# Altium schematic sheet Sheet1.SCHDOC
size 840 x 594 mm; SheetNumber: 1; SheetTotal: 1; DocumentName: Sheet1.SCHDOC
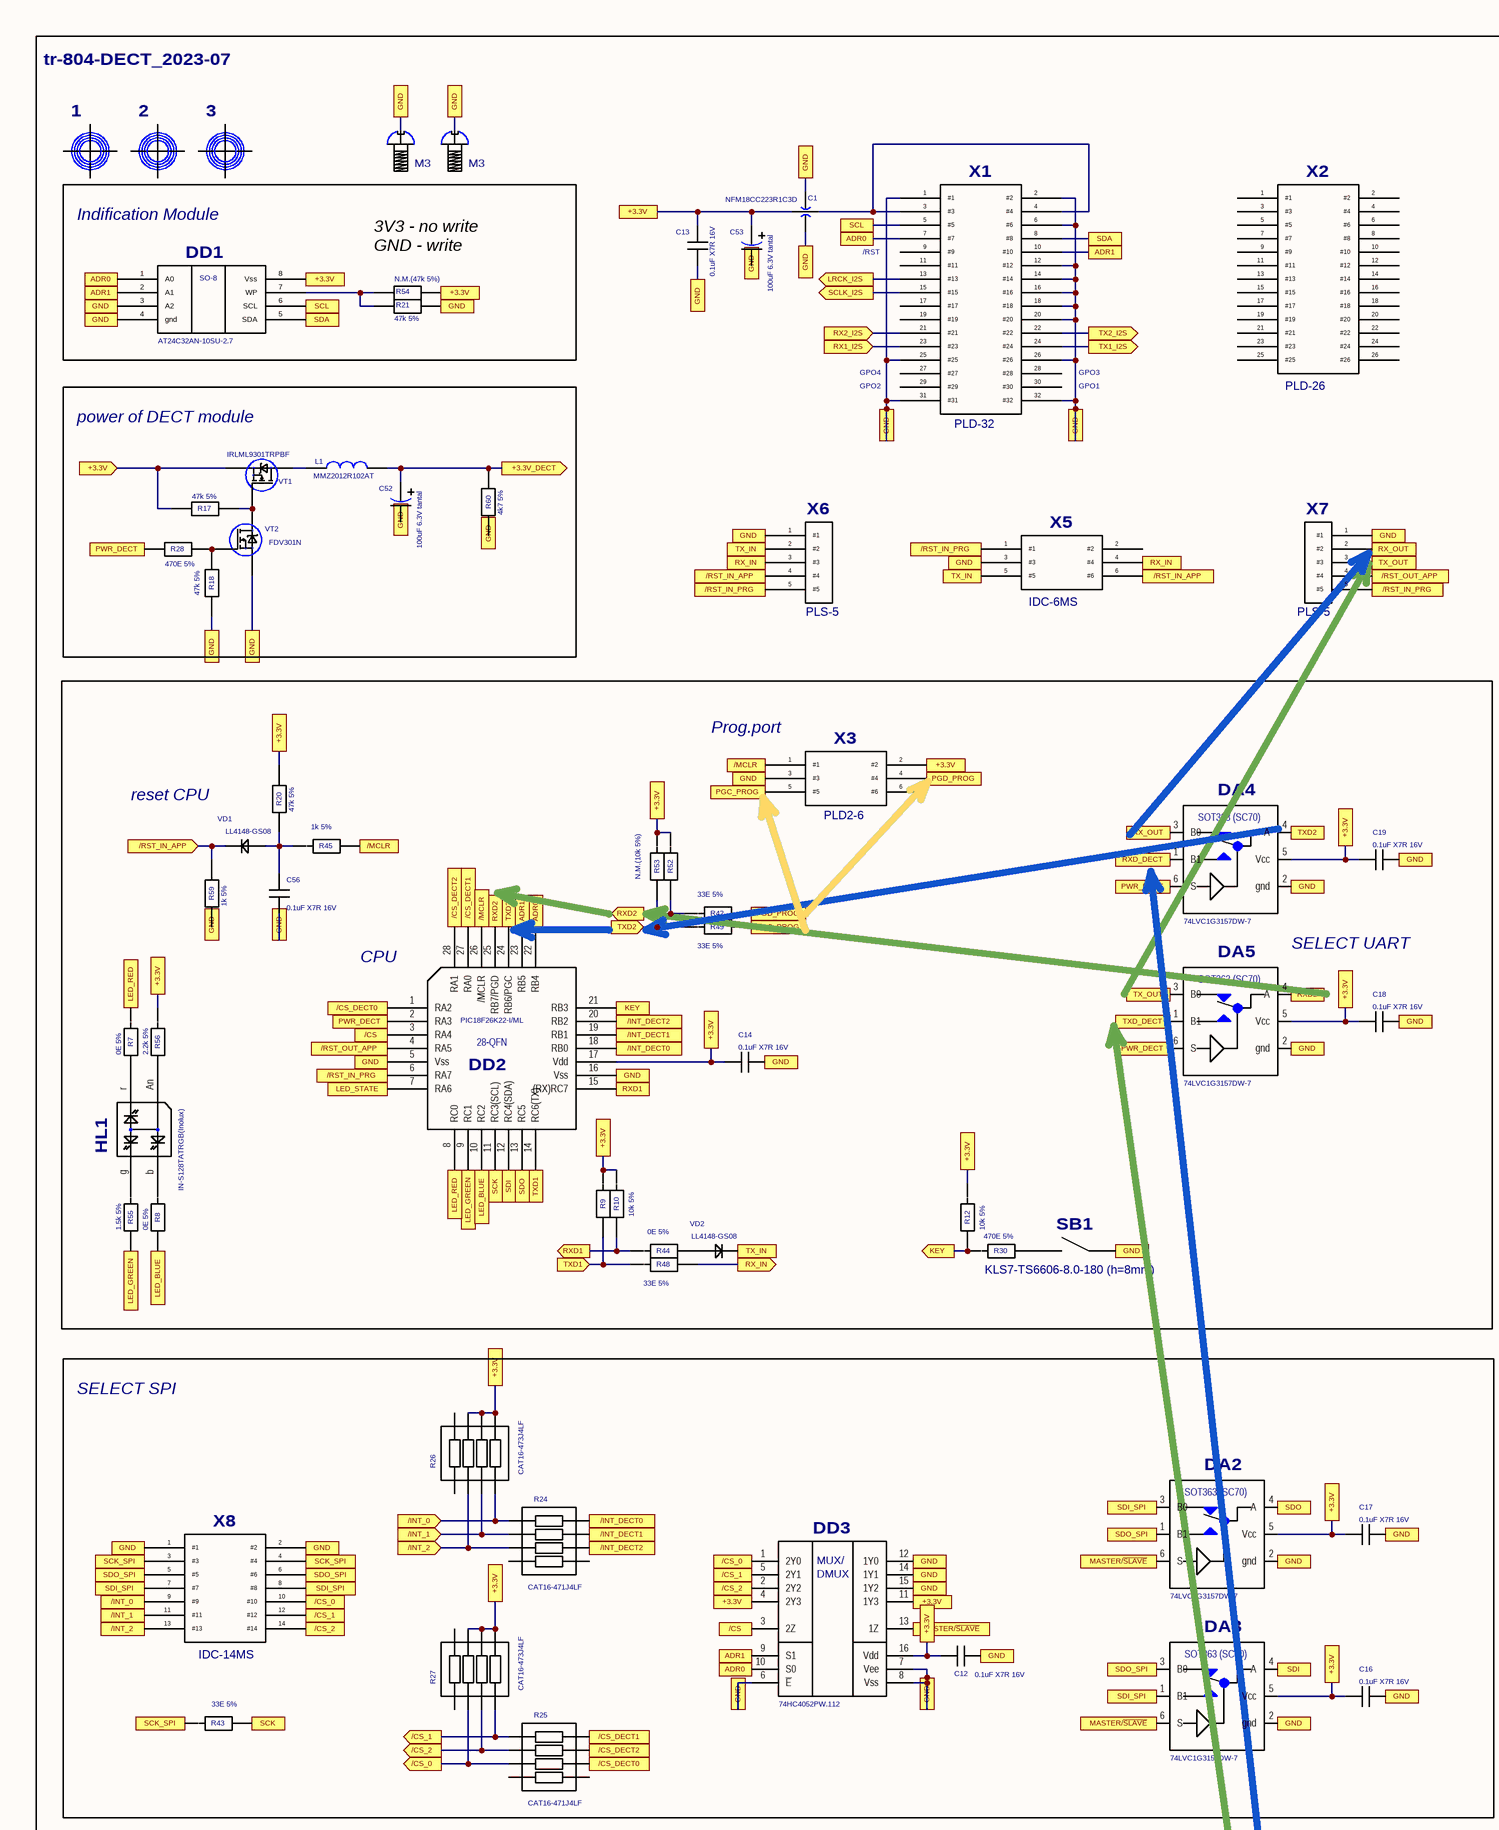
[diagram p0: Sheet1.SCHDOC, top left]
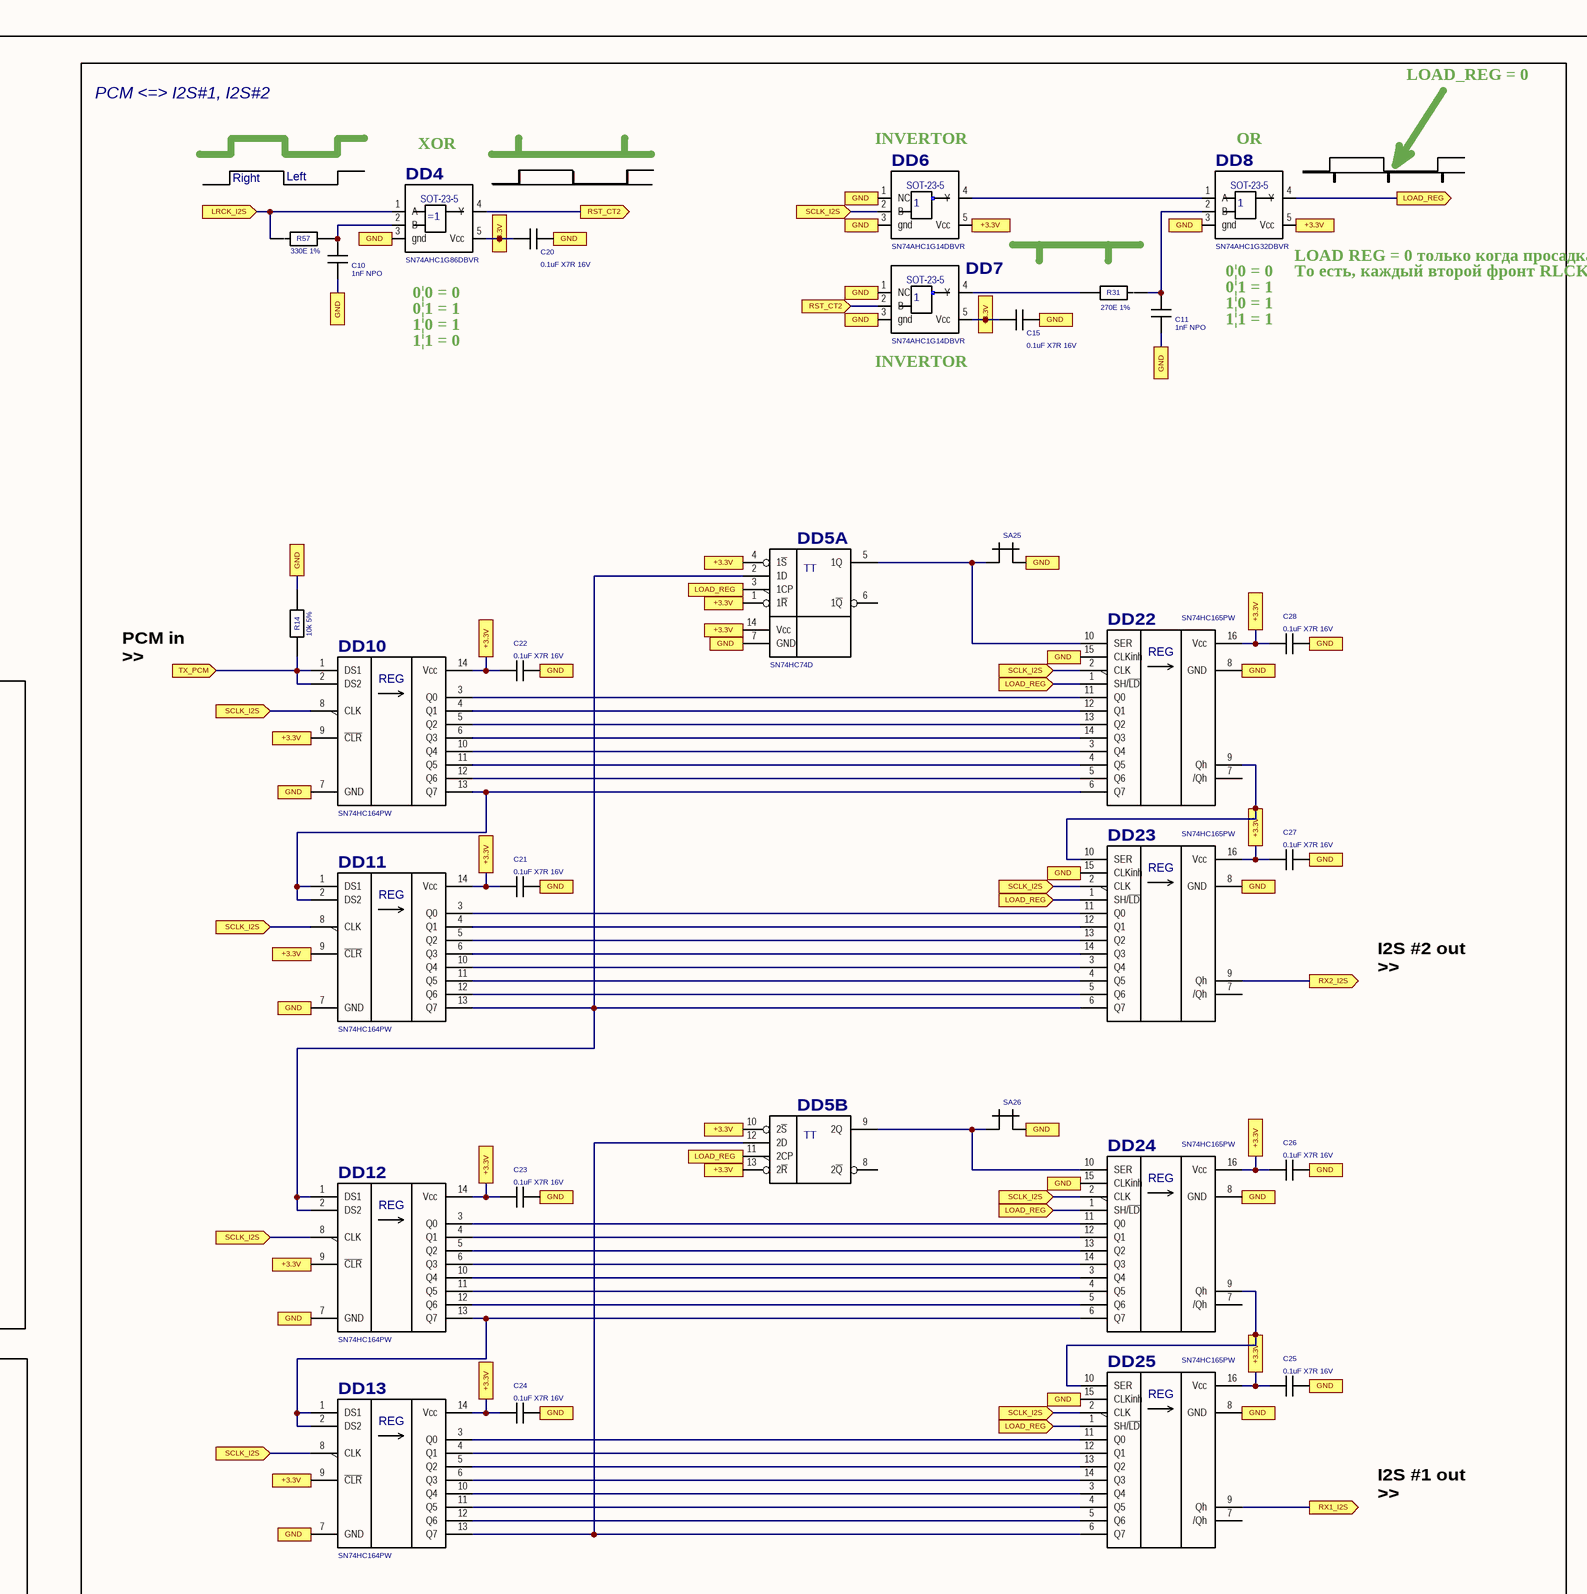
[diagram p1: Sheet1.SCHDOC, top middle]
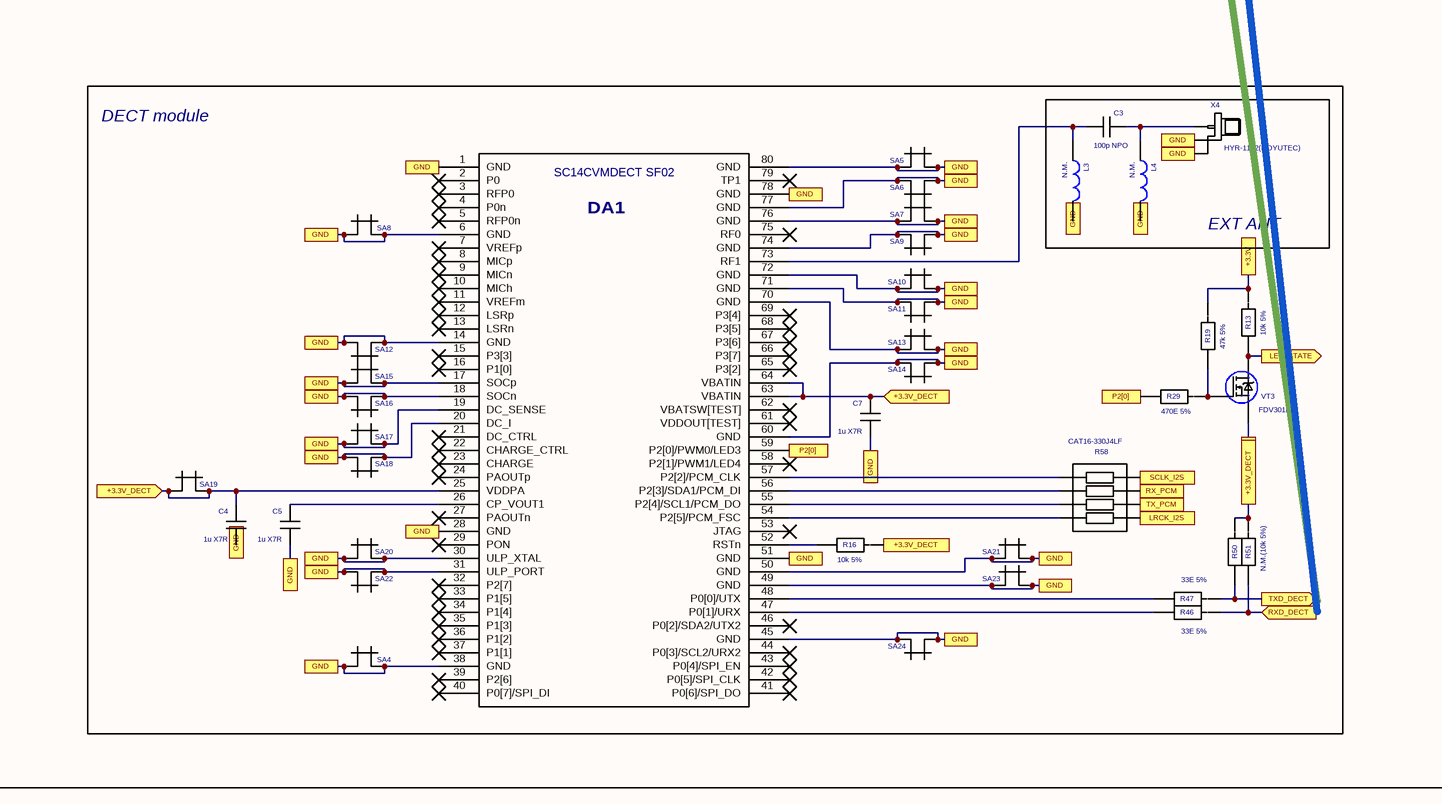
[diagram p2: Sheet1.SCHDOC, bottom left]
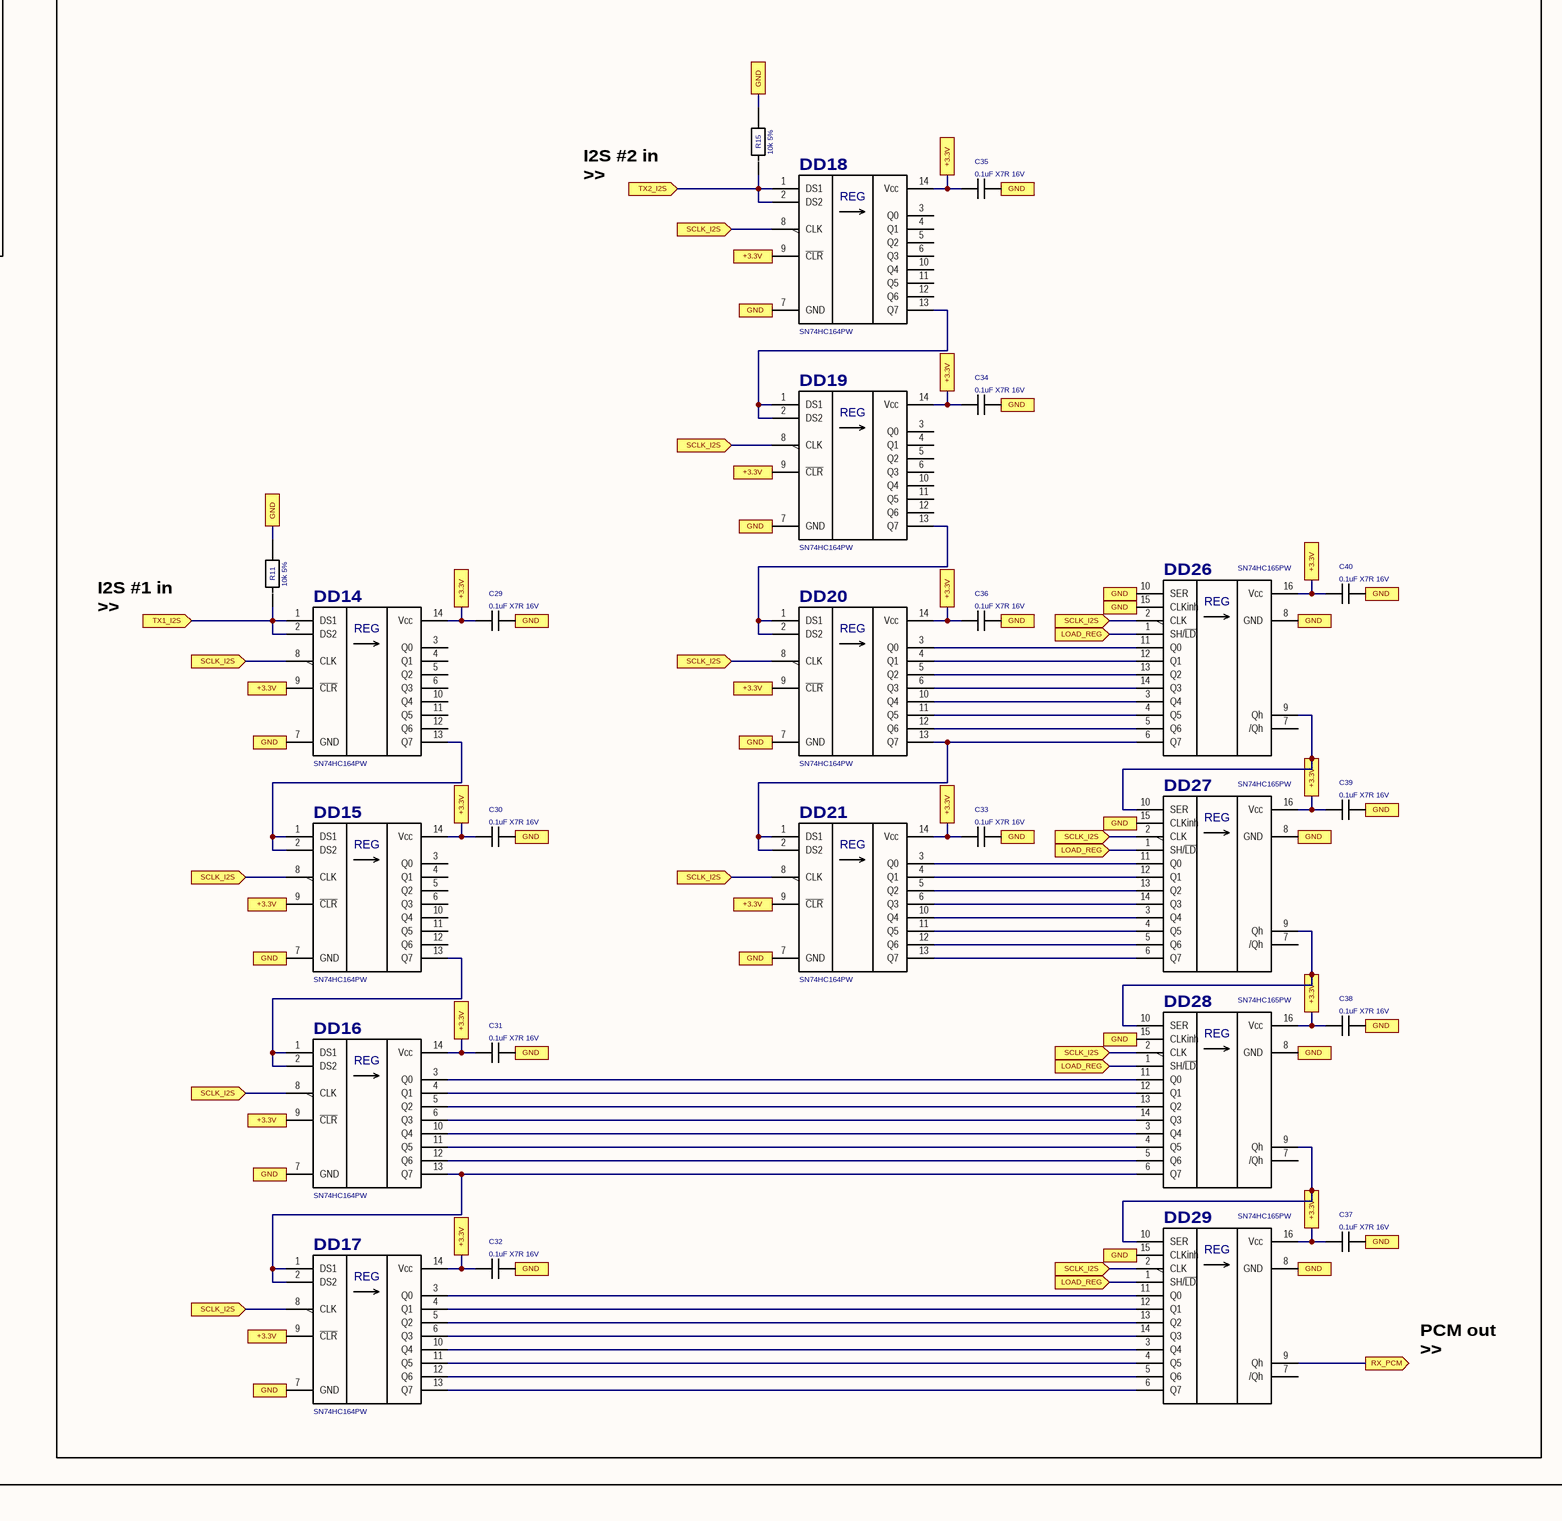
[diagram p3: Sheet1.SCHDOC, bottom middle]

## Parts
1  REPER_20-10  [REP_1]  (value not drawn)
2  REPER_20-10  [REP_1]  (value not drawn)
3  REPER_20-10  [REP_1]  (value not drawn)
C1  value NFM18CC223R1C3D  [0603_MURATA_NFM18PC]  (hidden comment: 0603_MURATA_NFM18PC)
C3  value 100p NPO  [0402]  (hidden comment: 0402_C)
C4  value 1u X7R  [0603]  (hidden comment: 0603_C)
C5  value 1u X7R  [0603]  (hidden comment: 0603_C)
C7  value 1u X7R  [0603]  (hidden comment: 0603_C)
C10  value 1nF NPO  [0603]  (hidden comment: 0603_C)
C11  value 1nF NPO  [0603]  (hidden comment: 0603_C)
C12  value 0.1uF X7R 16V  [0603]  (hidden comment: 0603_C)
C13  value 0.1uF X7R 16V  [0603]  (hidden comment: 0603_C)
C14  value 0.1uF X7R 16V  [0603]  (hidden comment: 0603_C)
C15  value 0.1uF X7R 16V  [0603]  (hidden comment: 0603_C)
C16  value 0.1uF X7R 16V  [0603]  (hidden comment: 0603_C)
C17  value 0.1uF X7R 16V  [0603]  (hidden comment: 0603_C)
C18  value 0.1uF X7R 16V  [0603]  (hidden comment: 0603_C)
C19  value 0.1uF X7R 16V  [0603]  (hidden comment: 0603_C)
C20  value 0.1uF X7R 16V  [0603]  (hidden comment: 0603_C)
C21  value 0.1uF X7R 16V  [0603]  (hidden comment: 0603_C)
C22  value 0.1uF X7R 16V  [0603]  (hidden comment: 0603_C)
C23  value 0.1uF X7R 16V  [0603]  (hidden comment: 0603_C)
C24  value 0.1uF X7R 16V  [0603]  (hidden comment: 0603_C)
C25  value 0.1uF X7R 16V  [0603]  (hidden comment: 0603_C)
C26  value 0.1uF X7R 16V  [0603]  (hidden comment: 0603_C)
C27  value 0.1uF X7R 16V  [0603]  (hidden comment: 0603_C)
C28  value 0.1uF X7R 16V  [0603]  (hidden comment: 0603_C)
C29  value 0.1uF X7R 16V  [0603]  (hidden comment: 0603_C)
C30  value 0.1uF X7R 16V  [0603]  (hidden comment: 0603_C)
C31  value 0.1uF X7R 16V  [0603]  (hidden comment: 0603_C)
C32  value 0.1uF X7R 16V  [0603]  (hidden comment: 0603_C)
C33  value 0.1uF X7R 16V  [0603]  (hidden comment: 0603_C)
C34  value 0.1uF X7R 16V  [0603]  (hidden comment: 0603_C)
C35  value 0.1uF X7R 16V  [0603]  (hidden comment: 0603_C)
C36  value 0.1uF X7R 16V  [0603]  (hidden comment: 0603_C)
C37  value 0.1uF X7R 16V  [0603]  (hidden comment: 0603_C)
C38  value 0.1uF X7R 16V  [0603]  (hidden comment: 0603_C)
C39  value 0.1uF X7R 16V  [0603]  (hidden comment: 0603_C)
C40  value 0.1uF X7R 16V  [0603]  (hidden comment: 0603_C)
C52  value 100uF 6.3V tantal  [CASE_B]  (hidden comment: CASEB_C+)
C53  value 100uF 6.3V tantal  [CASE_B]  (hidden comment: CASEB_C+)
C56  value 0.1uF X7R 16V  [0603]  (hidden comment: 0603_C)
DA1  value SC14CVMDECT SF02  [SC14CVMDECT(DECT)]  (hidden comment: DECT_SC14CVMDECT)
DA2  value 74LVC1G3157DW-7  [SC70-6]  (hidden comment: DA_SN74LVC(SWITCH-SOT363))
DA3  value 74LVC1G3157DW-7  [SC70-6]  (hidden comment: DA_SN74LVC(SWITCH-SOT363))
DA4  value 74LVC1G3157DW-7  [SC70-6]  (hidden comment: DA_SN74LVC(SWITCH-SOT363))
DA5  value 74LVC1G3157DW-7  [SC70-6]  (hidden comment: DA_SN74LVC(SWITCH-SOT363))
DD1  value AT24C32AN-10SU-2.7  [SO-8-1.27_PANTES]  (hidden comment: DD_AT24CXXX)
DD2  value PIC18F26K22-I/ML  [QFN-28(6X6)]  (hidden comment: DD_PIC18F2XK22(QFN))
DD3  value 74HC4052PW.112  [TSSOP-16-0.65_PANTES]  (hidden comment: DD_74HC4052PW)
DD4  value SN74AHC1G86DBVR  [SOT-25]  (hidden comment: DD_SN74AHC1G86DBVR(2XOR))
DD5  value SN74HC74D  [SO-14-1.27]  (hidden comment: DD_SN74HC74D)  (parts A,B of 2)
DD6  value SN74AHC1G14DBVR  [SOT-25]  (hidden comment: DD_SN74AHC1G14DBVR(NOT))
DD7  value SN74AHC1G14DBVR  [SOT-25]  (hidden comment: DD_SN74AHC1G14DBVR(NOT))
DD8  value SN74AHC1G32DBVR  [SOT-25]  (hidden comment: DD_SN74AHC1G32DBVR(2OR))
DD10  value SN74HC164PW  [TSSOP-14-0.65_PANTES]  (hidden comment: DD_SN74HC164PW)
DD11  value SN74HC164PW  [TSSOP-14-0.65_PANTES]  (hidden comment: DD_SN74HC164PW)
DD12  value SN74HC164PW  [TSSOP-14-0.65_PANTES]  (hidden comment: DD_SN74HC164PW)
DD13  value SN74HC164PW  [TSSOP-14-0.65_PANTES]  (hidden comment: DD_SN74HC164PW)
DD14  value SN74HC164PW  [TSSOP-14-0.65_PANTES]  (hidden comment: DD_SN74HC164PW)
DD15  value SN74HC164PW  [TSSOP-14-0.65_PANTES]  (hidden comment: DD_SN74HC164PW)
DD16  value SN74HC164PW  [TSSOP-14-0.65_PANTES]  (hidden comment: DD_SN74HC164PW)
DD17  value SN74HC164PW  [TSSOP-14-0.65_PANTES]  (hidden comment: DD_SN74HC164PW)
DD18  value SN74HC164PW  [TSSOP-14-0.65_PANTES]  (hidden comment: DD_SN74HC164PW)
DD19  value SN74HC164PW  [TSSOP-14-0.65_PANTES]  (hidden comment: DD_SN74HC164PW)
DD20  value SN74HC164PW  [TSSOP-14-0.65_PANTES]  (hidden comment: DD_SN74HC164PW)
DD21  value SN74HC164PW  [TSSOP-14-0.65_PANTES]  (hidden comment: DD_SN74HC164PW)
DD22  value SN74HC165PW  [TSSOP-16-0.65_PANTES]  (hidden comment: DD_SN74HC165PW)
DD23  value SN74HC165PW  [TSSOP-16-0.65_PANTES]  (hidden comment: DD_SN74HC165PW)
DD24  value SN74HC165PW  [TSSOP-16-0.65_PANTES]  (hidden comment: DD_SN74HC165PW)
DD25  value SN74HC165PW  [TSSOP-16-0.65_PANTES]  (hidden comment: DD_SN74HC165PW)
DD26  value SN74HC165PW  [TSSOP-16-0.65_PANTES]  (hidden comment: DD_SN74HC165PW)
DD27  value SN74HC165PW  [TSSOP-16-0.65_PANTES]  (hidden comment: DD_SN74HC165PW)
DD28  value SN74HC165PW  [TSSOP-16-0.65_PANTES]  (hidden comment: DD_SN74HC165PW)
DD29  value SN74HC165PW  [TSSOP-16-0.65_PANTES]  (hidden comment: DD_SN74HC165PW)
HL1  value IN-S128TATRGB(Inolux)  [1210LED_LPE1-5-19]  (hidden comment: LED_1210(LPE1-5-19))
L1  value MMZ2012R102AT  [0805]  (hidden comment: 0805_L)
L3  value N.M.  [0402]  (hidden comment: 0402_L)
L4  value N.M.  [0402]  (hidden comment: 0402_L)
M1  value M3  [M32]  (hidden comment: BOLT)
M2  value M3  [M32]  (hidden comment: BOLT)
R7  value 0E 5%  [0805]  (hidden comment: 0805_R)
R8  value 0E 5%  [0805]  (hidden comment: 0805_R)
R9  0603_R  [0603]  (value not drawn)
R10  value 10k 5%  [0603]  (hidden comment: 0603_R)
R11  value 10k 5%  [0603]  (hidden comment: 0603_R)
R12  value 10k 5%  [0603]  (hidden comment: 0603_R)
R13  value 10k 5%  [0603]  (hidden comment: 0603_R)
R14  value 10k 5%  [0603]  (hidden comment: 0603_R)
R15  value 10k 5%  [0603]  (hidden comment: 0603_R)
R16  value 10k 5%  [0603]  (hidden comment: 0603_R)
R17  value 47k 5%  [0603]  (hidden comment: 0603_R)
R18  value 47k 5%  [0603]  (hidden comment: 0603_R)
R19  value 47k 5%  [0603]  (hidden comment: 0603_R)
R20  value 47k 5%  [0603]  (hidden comment: 0603_R)
R21  value 47k 5%  [0603]  (hidden comment: 0603_R)
R24  value CAT16-471J4LF  [CAY16-J4]  (hidden comment: 0603_R_CAY16-J)
R25  value CAT16-471J4LF  [CAY16-J4]  (hidden comment: 0603_R_CAY16-J)
R26  value CAT16-473J4LF  [CAY16-J4]  (hidden comment: 0603_R_CAY16-J)
R27  value CAT16-473J4LF  [CAY16-J4]  (hidden comment: 0603_R_CAY16-J)
R28  value 470E 5%  [0603]  (hidden comment: 0603_R)
R29  value 470E 5%  [0603]  (hidden comment: 0603_R)
R30  value 470E 5%  [0603]  (hidden comment: 0603_R)
R31  value 270E 1%  [0603]  (hidden comment: 0603_R)
R42  value 33E 5%  [0603]  (hidden comment: 0603_R)
R43  value 33E 5%  [0603]  (hidden comment: 0603_R)
R44  value 0E 5%  [0603]  (hidden comment: 0603_R)
R45  value 1k 5%  [0603]  (hidden comment: 0603_R)
R46  value 33E 5%  [0603]  (hidden comment: 0603_R)
R47  value 33E 5%  [0603]  (hidden comment: 0603_R)
R48  value 33E 5%  [0603]  (hidden comment: 0603_R)
R49  value 33E 5%  [0603]  (hidden comment: 0603_R)
R50  0603_R  [0603]  (value not drawn)
R51  value N.M.(10k 5%)  [0603]  (hidden comment: 0603_R)
R52  value N.M.(10k 5%)  [0603]  (hidden comment: 0603_R)
R53  0603_R  [0603]  (value not drawn)
R54  value N.M.(47k 5%)  [0603]  (hidden comment: 0603_R)
R55  value 1.5k 5%  [0805]  (hidden comment: 0805_R)
R56  value 2.2k 5%  [0805]  (hidden comment: 0805_R)
R57  value 330E 1%  [0603]  (hidden comment: 0603_R)
R58  value CAT16-330J4LF  [CAY16-J4]  (hidden comment: 0603_R_CAY16-J)
R59  value 1k 5%  [0603]  (hidden comment: 0603_R)
R60  value 4k7 5%  [0603]  (hidden comment: 0603_R)
SA4  JUMPER_0603  [JUMPER_0603]  (value not drawn)
SA5  JUMPER_0603  [JUMPER_0603]  (value not drawn)
SA6  JUMPER_0603  [JUMPER_0603]  (value not drawn)
SA7  JUMPER_0603  [JUMPER_0603]  (value not drawn)
SA8  JUMPER_0603  [JUMPER_0603]  (value not drawn)
SA9  JUMPER_0603  [JUMPER_0603]  (value not drawn)
SA10  JUMPER_0603  [JUMPER_0603]  (value not drawn)
SA11  JUMPER_0603  [JUMPER_0603]  (value not drawn)
SA12  JUMPER_0603  [JUMPER_0603]  (value not drawn)
SA13  JUMPER_0603  [JUMPER_0603]  (value not drawn)
SA14  JUMPER_0603  [JUMPER_0603]  (value not drawn)
SA15  JUMPER_0603  [JUMPER_0603]  (value not drawn)
SA16  JUMPER_0603  [JUMPER_0603]  (value not drawn)
SA17  JUMPER_0603  [JUMPER_0603]  (value not drawn)
SA18  JUMPER_0603  [JUMPER_0603]  (value not drawn)
SA19  JUMPER_0603  [JUMPER_0603]  (value not drawn)
SA20  JUMPER_0603  [JUMPER_0603]  (value not drawn)
SA21  JUMPER_0603  [JUMPER_0603]  (value not drawn)
SA22  JUMPER_0603  [JUMPER_0603]  (value not drawn)
SA23  JUMPER_0603  [JUMPER_0603]  (value not drawn)
SA24  JUMPER_0603  [JUMPER_0603]  (value not drawn)
SA25  JUMPER_0603  [JUMPER_0603]  (value not drawn)
SA26  JUMPER_0603  [JUMPER_0603]  (value not drawn)
SB1  value KLS7-TS6606-8.0-180 (h=8mm)  [BUTTON_TC-0206]  (hidden comment: BUT_TC-0206)
VD1  value LL4148-GS08  [SOD80C]  (hidden comment: DIOD_SOD80C)
VD2  value LL4148-GS08  [SOD80C]  (hidden comment: DIOD_SOD80C)
VT1  value IRLML9301TRPBF  [SOT-23]  (hidden comment: VT_FDN338P)
VT2  value FDV301N  [SOT-23]  (hidden comment: VT_FDV301N)
VT3  value FDV301N  [SOT-23]  (hidden comment: VT_FDV301N)
X1  value PLD-32  [PBD-32]  (hidden comment: X_PBD-32)
X2  value PLD-26  [PBD-26]  (hidden comment: X_PBD-26)
X3  value PLD2-6  [PBD2-6]  (hidden comment: X_PBD2-6)
X4  value HYR-1142(HOYUTEC)  [SMA_HYR-1142]  (hidden comment: X_SMA_HYR-1142)
X5  value IDC-6MS  [IDC-6]  (hidden comment: X_IDC-6)
X6  value PLS-5  [PLS-5]  (hidden comment: X_PLS-5)
X7  value PLS-5  [PLS-5]  (hidden comment: X_PLS-5)
X8  value IDC-14MS  [IDC-14]  (hidden comment: X_IDC-14)

## Blocks framed on the sheet
Indification Module: DD1 R21 R54
power of DECT module: C52 L1 R17 R18 R28 R60 VT1 VT2
SELECT SPI: C12 C16 C17 DA2 DA3 DD3 R24-R27 R43 X8
DECT module: C4 C5 C7 DA1 R13 R16 R19 R29 R46 R47 R50 R51 R58 SA4-SA24 VT3
EXT ANT: C3 L3 L4 X4

## Ports
+3.3V, +3.3V (in), +3.3V_DECT, +3.3V_DECT (in), +3.3V_DECT (out), /CS (in), /CS (out), /CS_0, /CS_0 (in), /CS_0 (out), /CS_1, /CS_1 (in), /CS_1 (out), /CS_2, /CS_2 (in), /CS_2 (out), /CS_DECT0 (in), /CS_DECT0 (out), /CS_DECT1 (in), /CS_DECT1 (out), /CS_DECT2 (in), /CS_DECT2 (out), /INT_0, /INT_0 (in), /INT_1, /INT_1 (in), /INT_2, /INT_2 (in), /INT_DECT0 (in), /INT_DECT0 (out), /INT_DECT1 (in), /INT_DECT1 (out), /INT_DECT2 (in), /INT_DECT2 (out), /MCLR, /MCLR (in), /MCLR (out), /RST_IN_APP, /RST_IN_APP (in), /RST_IN_PRG, /RST_IN_PRG (in), /RST_OUT_APP, /RST_OUT_APP (out), ADR0, ADR0 (in), ADR1, ADR1 (in), GND, KEY (in), KEY (out), LED_BLUE, LED_BLUE (out), LED_GREEN, LED_GREEN (out), LED_RED, LED_RED (out), LED_STATE (in), LED_STATE (out), LOAD_REG (in), LOAD_REG (out), LRCK_I2S (in), LRCK_I2S (out), MASTER/~{SLAVE} (in), MASTER/~{SLAVE} (out), P2[0] (in), P2[0] (out), PGC_PROG, PGD_PROG, PWR_DECT (in), PWR_DECT (out), RST_CT2 (in), RST_CT2 (out), RX1_I2S (in), RX1_I2S (out), RX2_I2S (in), RX2_I2S (out), RX_IN, RX_IN (out), RX_OUT, RX_OUT (out), RX_PCM (in), RX_PCM (out), RXD1 (in), RXD1 (out), RXD2 (in), RXD2 (out), RXD_DECT (in), RXD_DECT (out), SCK, SCK_SPI, SCL, SCLK_I2S (in), SCLK_I2S (out), SDA, SDI (in), SDI (out), SDI_SPI, SDI_SPI (in), SDI_SPI (out), SDO (in), SDO (out), SDO_SPI, SDO_SPI (in), SDO_SPI (out), TX1_I2S (in), TX1_I2S (out), TX2_I2S (in), TX2_I2S (out), TX_IN, TX_IN (in), TX_OUT, TX_OUT (in), TX_PCM (in), TX_PCM (out), TXD1 (in), TXD1 (out), TXD2 (in), TXD2 (out), TXD_DECT (in), TXD_DECT (out)

## Nets
+3.3V: C1.3 C12.1 C13.1 C14.1 C15.1 C16.1 C17.1 C18.1 C19.1 C20.1 C21.1 C22.1 C23.1 C24.1 C25.1 C26.1 C27.1 C28.1 C29.1 C30.1 C31.1 C32.1 C33.1 C34.1 C35.1 C36.1 C37.1 C38.1 C39.1 C40.1 C53.1 DA2.5(Vcc) DA3.5(Vcc) DA4.5(Vcc) DA5.5(Vcc) DD1.8(Vss) DD2.17(Vdd) DD3.4(2Y3) DD3.11(1Y3) DD3.16(Vdd) DD4.5(Vcc) DD5.1(1~{R}) DD5.4(1~{S}) DD5.10(2~{S}) DD5.13(2~{R}) DD5.14(Vcc) DD6.5(Vcc) DD7.5(Vcc) DD8.5(Vcc) DD10.9(~{CLR}) DD10.14(Vcc) DD11.9(~{CLR}) DD11.14(Vcc) DD12.9(~{CLR}) DD12.14(Vcc) DD13.9(~{CLR}) DD13.14(Vcc) DD14.9(~{CLR}) DD14.14(Vcc) DD15.9(~{CLR}) DD15.14(Vcc) DD16.9(~{CLR}) DD16.14(Vcc) DD17.9(~{CLR}) DD17.14(Vcc) DD18.9(~{CLR}) DD18.14(Vcc) DD19.9(~{CLR}) DD19.14(Vcc) DD20.9(~{CLR}) DD20.14(Vcc) DD21.9(~{CLR}) DD21.14(Vcc) DD22.9(Qh) DD22.16(Vcc) DD23.10(SER) DD23.16(Vcc) DD24.9(Qh) DD24.16(Vcc) DD25.10(SER) DD25.16(Vcc) DD26.9(Qh) DD26.16(Vcc) DD27.9(Qh) DD27.10(SER) DD27.16(Vcc) DD28.9(Qh) DD28.10(SER) DD28.16(Vcc) DD29.10(SER) DD29.16(Vcc) R9.2 R10.2 R12.2 R13.2 R17.1 R19.2 R20.1 R26.4 R26.6 R26.8 R27.4 R27.6 R27.8 R52.2 R53.2 R54.2 R56.2 VT1.3(S) X3.2(#2) ; port +3.3V
+3.3V_DECT: C4.1 C7.1 C52.1 DA1.25(VDDPA) DA1.63(VBATIN) DA1.64(VBATIN) L1.2 R16.2 R50.2 R51.2 R60.1 SA19.1(#1) SA19.2(#2) ; port +3.3V_DECT
/CS: DD2.3(RA4) DD3.3(2Z) ; port /CS
/CS_0: DD3.1(2Y0) R25.5 R27.3 X8.10(#10) ; port /CS_0
/CS_1: DD3.5(2Y1) R25.1 R27.7 X8.12(#12) ; port /CS_1
/CS_2: DD3.2(2Y2) R25.3 R27.5 X8.14(#14) ; port /CS_2
/CS_DECT0: DD2.1(RA2) R25.6 ; port /CS_DECT0
/CS_DECT1: DD2.27(RA0) R25.2 ; port /CS_DECT1
/CS_DECT2: DD2.28(RA1) R25.4 ; port /CS_DECT2
/INT_0: R24.1 R26.7 X8.9(#9) ; port /INT_0
/INT_1: R24.3 R26.5 X8.11(#11) ; port /INT_1
/INT_2: R24.5 R26.3 X8.13(#13) ; port /INT_2
/INT_DECT0: DD2.18(RB0) R24.2 ; port /INT_DECT0
/INT_DECT1: DD2.19(RB1) R24.4 ; port /INT_DECT1
/INT_DECT2: DD2.20(RB2) R24.6 ; port /INT_DECT2
/MCLR: DD2.26(/MCLR) R45.1 X3.1(#1) ; port /MCLR
/RST_IN_APP: R59.1 VD1.K X5.6(#6) X6.4(#4) ; port /RST_IN_APP
/RST_IN_PRG: DD2.6(RA7) X5.1(#1) X6.5(#5) X7.5(#5) ; port /RST_IN_PRG
/RST_OUT_APP: DD2.4(RA5) X7.4(#4) ; port /RST_OUT_APP
ADR0: DD1.1(A0) DD2.22(RB4) DD3.10(S0) X1.7(#7) ; port ADR0
ADR1: DD1.2(A1) DD2.23(RB5) DD3.9(S1) X1.10(#10) ; port ADR1
GND: C1.2 C1.4 C4.2 C5.2 C7.2 C10.2 C11.2 C12.2 C13.2 C14.2 C15.2 C16.2 C17.2 C18.2 C19.2 C20.2 C21.2 C22.2 C23.2 C24.2 C25.2 C26.2 C27.2 C28.2 C29.2 C30.2 C31.2 C32.2 C33.2 C34.2 C35.2 C36.2 C37.2 C38.2 C39.2 C40.2 C52.2 C53.2 C56.2 DA1.1(GND) DA1.6(GND) DA1.14(GND) DA1.17(SOCp) DA1.18(SOCn) DA1.19(DC_SENSE) DA1.20(DC_I) DA1.28(GND) DA1.30(ULP_XTAL) DA1.31(ULP_PORT) DA1.38(GND) DA1.45(GND) DA1.49(GND) DA1.50(GND) DA1.51(GND) DA1.60(GND) DA1.70(GND) DA1.71(GND) DA1.72(GND) DA1.74(GND) DA1.76(GND) DA1.77(GND) DA1.78(GND) DA1.80(GND) DA2.2(gnd) DA3.2(gnd) DA4.2(gnd) DA5.2(gnd) DD1.3(A2) DD1.4(gnd) DD2.5(Vss) DD2.16(Vss) DD3.6(~{E}) DD3.7(Vee) DD3.8(Vss) DD3.12(1Y0) DD3.14(1Y1) DD3.15(1Y2) DD4.3(gnd) DD5.7(GND) DD6.1(NC) DD6.3(gnd) DD7.1(NC) DD7.3(gnd) DD8.3(gnd) DD10.7(GND) DD11.7(GND) DD12.7(GND) DD13.7(GND) DD14.7(GND) DD15.7(GND) DD16.7(GND) DD17.7(GND) DD18.7(GND) DD19.7(GND) DD20.7(GND) DD21.7(GND) DD22.8(GND) DD22.15(CLKinh) DD23.8(GND) DD23.15(CLKinh) DD24.8(GND) DD24.15(CLKinh) DD25.8(GND) DD25.15(CLKinh) DD26.8(GND) DD26.10(SER) DD26.15(CLKinh) DD27.8(GND) DD27.15(CLKinh) DD28.8(GND) DD28.15(CLKinh) DD29.8(GND) DD29.15(CLKinh) L3.2 L4.2 M1.1 M2.1 R11.1 R14.1 R15.1 R18.2 R21.2 R59.2 R60.2 SA4.1(#1) SA4.2(#2) SA5.1(#1) SA5.2(#2) SA6.1(#1) SA6.2(#2) SA7.1(#1) SA7.2(#2) SA8.1(#1) SA8.2(#2) SA9.1(#1) SA9.2(#2) SA10.1(#1) SA10.2(#2) SA11.1(#1) SA11.2(#2) SA12.1(#1) SA12.2(#2) SA13.1(#1) SA13.2(#2) SA14.1(#1) SA14.2(#2) SA15.1(#1) SA15.2(#2) SA16.1(#1) SA16.2(#2) SA17.1(#1) SA17.2(#2) SA18.1(#1) SA18.2(#2) SA20.1(#1) SA20.2(#2) SA21.1(#1) SA21.2(#2) SA22.1(#1) SA22.2(#2) SA23.1(#1) SA23.2(#2) SA24.1(#1) SA24.2(#2) SA25.2(#2) SA26.2(#2) SB1.1 VT2.3(S) VT3.3(S) X1.1(#1) X1.2(#2) X1.6(#6) X1.12(#12) X1.14(#14) X1.16(#16) X1.18(#18) X1.20(#20) X1.25(#25) X1.26(#26) X1.31(#31) X1.32(#32) X3.3(#3) X4.2 X4.3 X5.3(#3) X6.1(#1) X7.1(#1) X8.1(#1) X8.2(#2) ; port GND
KEY: DD2.21(RB3) R12.1 R30.2 ; port KEY
LED_BLUE: DD2.10(RC2) R8.1 ; port LED_BLUE
LED_GREEN: DD2.9(RC1) R55.1 ; port LED_GREEN
LED_RED: DD2.8(RC0) R7.2 ; port LED_RED
LED_STATE: DD2.7(RA6) R13.1 VT3.2(D) ; port LED_STATE
LOAD_REG: DD5.3(1CP) DD5.11(2CP) DD8.4(Y) DD22.1(SH/~{LD}) DD23.1(SH/~{LD}) DD24.1(SH/~{LD}) DD25.1(SH/~{LD}) DD26.1(SH/~{LD}) DD27.1(SH/~{LD}) DD28.1(SH/~{LD}) DD29.1(SH/~{LD}) ; port LOAD_REG
LRCK_I2S: DD4.1(A) R57.2 R58.8 X1.13(#13) ; port LRCK_I2S
MASTER/~{SLAVE}: DA2.6(S) DA3.6(S) DD3.13(1Z) ; port MASTER/~{SLAVE}
P2[0]: DA1.59(P2[0]/PWM0/LED3) R29.1 ; port P2[0]
PGC_PROG: R49.1 X3.5(#5) ; port PGC_PROG
PGD_PROG: R42.1 X3.4(#4) ; port PGD_PROG
PWR_DECT: DA4.6(S) DA5.6(S) DD2.2(RA3) R28.1 ; port PWR_DECT
RST_CT2: DD4.4(Y) DD7.2(B) ; port RST_CT2
RX1_I2S: DD25.9(Qh) X1.23(#23) ; port RX1_I2S
RX2_I2S: DD23.9(Qh) X1.21(#21) ; port RX2_I2S
RX_IN: R48.1 X5.4(#4) X6.3(#3) ; port RX_IN
RX_OUT: DA4.3(B0) X7.2(#2) ; port RX_OUT
RX_PCM: DD29.9(Qh) R58.4 ; port RX_PCM
RXD1: DD2.15((RX)RC7) R10.1 R44.2 ; port RXD1
RXD2: DA5.4(A) DD2.25(RB7/PGD) R42.2 R52.1 ; port RXD2
RXD_DECT: DA4.1(B1) R46.2 R51.1 ; port RXD_DECT
SCK: DD2.11(RC3(SCL)) R43.1 ; port SCK
SCK_SPI: R43.2 X8.3(#3) X8.4(#4) ; port SCK_SPI
SCL: DD1.6(SCL) X1.5(#5) ; port SCL
SCLK_I2S: DD6.2(B) DD10.8(CLK) DD11.8(CLK) DD12.8(CLK) DD13.8(CLK) DD14.8(CLK) DD15.8(CLK) DD16.8(CLK) DD17.8(CLK) DD18.8(CLK) DD19.8(CLK) DD20.8(CLK) DD21.8(CLK) DD22.2(CLK) DD23.2(CLK) DD24.2(CLK) DD25.2(CLK) DD26.2(CLK) DD27.2(CLK) DD28.2(CLK) DD29.2(CLK) R58.2 X1.15(#15) ; port SCLK_I2S
SDA: DD1.5(SDA) X1.8(#8) ; port SDA
SDI: DA3.4(A) DD2.12(RC4(SDA)) ; port SDI
SDI_SPI: DA2.3(B0) DA3.1(B1) X8.7(#7) X8.8(#8) ; port SDI_SPI
SDO: DA2.4(A) DD2.13(RC5) ; port SDO
SDO_SPI: DA2.1(B1) DA3.3(B0) X8.5(#5) X8.6(#6) ; port SDO_SPI
TX1_I2S: DD14.1(DS1) DD14.2(DS2) R11.2 X1.24(#24) ; port TX1_I2S
TX2_I2S: DD18.1(DS1) DD18.2(DS2) R15.2 X1.22(#22) ; port TX2_I2S
TX_IN: VD2.K X5.5(#5) X6.2(#2) ; port TX_IN
TX_OUT: DA5.3(B0) X7.3(#3) ; port TX_OUT
TX_PCM: DD10.1(DS1) DD10.2(DS2) R14.2 R58.6 ; port TX_PCM
TXD1: DD2.14(RC6(TX)) R9.1 R48.2 ; port TXD1
TXD2: DA4.4(A) DD2.24(RB6/PGC) R49.2 R53.1 ; port TXD2
TXD_DECT: DA5.1(B1) R47.2 R50.1 ; port TXD_DECT
NetC1_1: C1.1 X1.3(#3) X1.4(#4)
NetC3_1: C3.1 DA1.73(RF1) L3.1
NetC3_2: C3.2 L4.1 X4.1
NetC5_1: C5.1 DA1.26(CP_VOUT1)
NetC10_1: C10.1 DD4.2(B) R57.1
NetC11_1: C11.1 DD8.2(B) R31.2
NetC56_1: C56.1 R20.2 R45.2 VD1.A
NetDA1_47: DA1.47(P0[1]/URX) R46.1
NetDA1_48: DA1.48(P0[0]/UTX) R47.1
NetDA1_52: DA1.52(RSTn) R16.1
NetDA1_54: DA1.54(P2[5]/PCM_FSC) R58.7
NetDA1_55: DA1.55(P2[4]/SCL1/PCM_DO) R58.5
NetDA1_56: DA1.56(P2[3]/SDA1/PCM_DI) R58.3
NetDA1_57: DA1.57(P2[2]/PCM_CLK) R58.1
NetDD1_7: DD1.7(WP) R21.1 R54.1
NetDD5_2: DD5.2(1D) DD11.13(Q7) DD12.1(DS1) DD12.2(DS2) DD23.6(Q7)
NetDD5_5: DD5.5(1Q) DD22.10(SER) SA25.1(#1)
NetDD5_9: DD5.9(2Q) DD24.10(SER) SA26.1(#1)
NetDD5_12: DD5.12(2D) DD13.13(Q7) DD25.6(Q7)
NetDD6_4: DD6.4(Y) DD8.1(A)
NetDD7_4: DD7.4(Y) R31.1
NetDD10_3: DD10.3(Q0) DD22.11(Q0)
NetDD10_4: DD10.4(Q1) DD22.12(Q1)
NetDD10_5: DD10.5(Q2) DD22.13(Q2)
NetDD10_6: DD10.6(Q3) DD22.14(Q3)
NetDD10_10: DD10.10(Q4) DD22.3(Q4)
NetDD10_11: DD10.11(Q5) DD22.4(Q5)
NetDD10_12: DD10.12(Q6) DD22.5(Q6)
NetDD10_13: DD10.13(Q7) DD11.1(DS1) DD11.2(DS2) DD22.6(Q7)
NetDD11_3: DD11.3(Q0) DD23.11(Q0)
NetDD11_4: DD11.4(Q1) DD23.12(Q1)
NetDD11_5: DD11.5(Q2) DD23.13(Q2)
NetDD11_6: DD11.6(Q3) DD23.14(Q3)
NetDD11_10: DD11.10(Q4) DD23.3(Q4)
NetDD11_11: DD11.11(Q5) DD23.4(Q5)
NetDD11_12: DD11.12(Q6) DD23.5(Q6)
NetDD12_3: DD12.3(Q0) DD24.11(Q0)
NetDD12_4: DD12.4(Q1) DD24.12(Q1)
NetDD12_5: DD12.5(Q2) DD24.13(Q2)
NetDD12_6: DD12.6(Q3) DD24.14(Q3)
NetDD12_10: DD12.10(Q4) DD24.3(Q4)
NetDD12_11: DD12.11(Q5) DD24.4(Q5)
NetDD12_12: DD12.12(Q6) DD24.5(Q6)
NetDD12_13: DD12.13(Q7) DD13.1(DS1) DD13.2(DS2) DD24.6(Q7)
NetDD13_3: DD13.3(Q0) DD25.11(Q0)
NetDD13_4: DD13.4(Q1) DD25.12(Q1)
NetDD13_5: DD13.5(Q2) DD25.13(Q2)
NetDD13_6: DD13.6(Q3) DD25.14(Q3)
NetDD13_10: DD13.10(Q4) DD25.3(Q4)
NetDD13_11: DD13.11(Q5) DD25.4(Q5)
NetDD13_12: DD13.12(Q6) DD25.5(Q6)
NetDD14_13: DD14.13(Q7) DD15.1(DS1) DD15.2(DS2)
NetDD15_13: DD15.13(Q7) DD16.1(DS1) DD16.2(DS2)
NetDD16_3: DD16.3(Q0) DD28.11(Q0)
NetDD16_4: DD16.4(Q1) DD28.12(Q1)
NetDD16_5: DD16.5(Q2) DD28.13(Q2)
NetDD16_6: DD16.6(Q3) DD28.14(Q3)
NetDD16_10: DD16.10(Q4) DD28.3(Q4)
NetDD16_11: DD16.11(Q5) DD28.4(Q5)
NetDD16_12: DD16.12(Q6) DD28.5(Q6)
NetDD16_13: DD16.13(Q7) DD17.1(DS1) DD17.2(DS2) DD28.6(Q7)
NetDD17_3: DD17.3(Q0) DD29.11(Q0)
NetDD17_4: DD17.4(Q1) DD29.12(Q1)
NetDD17_5: DD17.5(Q2) DD29.13(Q2)
NetDD17_6: DD17.6(Q3) DD29.14(Q3)
NetDD17_10: DD17.10(Q4) DD29.3(Q4)
NetDD17_11: DD17.11(Q5) DD29.4(Q5)
NetDD17_12: DD17.12(Q6) DD29.5(Q6)
NetDD17_13: DD17.13(Q7) DD29.6(Q7)
NetDD18_13: DD18.13(Q7) DD19.1(DS1) DD19.2(DS2)
NetDD19_13: DD19.13(Q7) DD20.1(DS1) DD20.2(DS2)
NetDD20_3: DD20.3(Q0) DD26.11(Q0)
NetDD20_4: DD20.4(Q1) DD26.12(Q1)
NetDD20_5: DD20.5(Q2) DD26.13(Q2)
NetDD20_6: DD20.6(Q3) DD26.14(Q3)
NetDD20_10: DD20.10(Q4) DD26.3(Q4)
NetDD20_11: DD20.11(Q5) DD26.4(Q5)
NetDD20_12: DD20.12(Q6) DD26.5(Q6)
NetDD20_13: DD20.13(Q7) DD21.1(DS1) DD21.2(DS2) DD26.6(Q7)
NetDD21_3: DD21.3(Q0) DD27.11(Q0)
NetDD21_4: DD21.4(Q1) DD27.12(Q1)
NetDD21_5: DD21.5(Q2) DD27.13(Q2)
NetDD21_6: DD21.6(Q3) DD27.14(Q3)
NetDD21_10: DD21.10(Q4) DD27.3(Q4)
NetDD21_11: DD21.11(Q5) DD27.4(Q5)
NetDD21_12: DD21.12(Q6) DD27.5(Q6)
NetDD21_13: DD21.13(Q7) DD27.6(Q7)
NetHL1_An: HL1.An R56.1
NetHL1_b: HL1.b R8.2
NetHL1_g: HL1.g R55.2
NetHL1_r: HL1.r R7.1
NetL1_1: L1.1 VT1.2(D)
NetR17_2: R17.2 VT1.1(G) VT2.2(D)
NetR18_1: R18.1 R28.2 VT2.1(G)
NetR19_1: R19.1 R29.2 VT3.1(G)
NetR30_1: R30.1 SB1.2
NetR44_1: R44.1 VD2.A

Not connected (* = marked no-connect by the designer): 1 1; 2 1; 3 1; DA1 2(P0) 3(RFP0) 4(P0n) 5(RFP0n) 7(VREFp) 8(MICp) 9(MICn) 10(MICh) 11(VREFm) 12(LSRp) 13(LSRn) 15(P3[3]) 16(P1[0]) 21(DC_CTRL) 22(CHARGE_CTRL) 23(CHARGE) 24(PAOUTp) 27(PAOUTn) 29(PON) 32(P2[7]) 33(P1[5]) 34(P1[4]) 35(P1[3]) 36(P1[2]) 37(P1[1]) 39(P2[6]) 40(P0[7]/SPI_DI) 41(P0[6]/SPI_DO) 42(P0[5]/SPI_CLK) 43(P0[4]/SPI_EN) 44(P0[3]/SCL2/URX2) 46(P0[2]/SDA2/UTX2) 53(JTAG) 58(P2[1]/PWM1/LED4) 61(VDDOUT[TEST]) 62(VBATSW[TEST]) 65(P3[2]) 66(P3[7]) 67(P3[6]) 68(P3[5]) 69(P3[4]) 75(RF0) 79(TP1); DD2 29; DD5 6(1~{Q}) 8(2~{Q}); DD14 3(Q0) 4(Q1) 5(Q2) 6(Q3) 10(Q4) 11(Q5) 12(Q6); DD15 3(Q0) 4(Q1) 5(Q2) 6(Q3) 10(Q4) 11(Q5) 12(Q6); DD18 3(Q0) 4(Q1) 5(Q2) 6(Q3) 10(Q4) 11(Q5) 12(Q6); DD19 3(Q0) 4(Q1) 5(Q2) 6(Q3) 10(Q4) 11(Q5) 12(Q6); DD22 7(/Qh); DD23 7(/Qh); DD24 7(/Qh); DD25 7(/Qh); DD26 7(/Qh); DD27 7(/Qh); DD28 7(/Qh); DD29 7(/Qh); R24 7 8; R25 7 8; R26 1 2; R27 1 2; SB1 3 4; X1 9(#9) 11(#11) 17(#17) 19(#19) 27(#27) 28(#28) 29(#29) 30(#30); X2 1(#1) 2(#2) 3(#3) 4(#4) 5(#5) 6(#6) 7(#7) 8(#8) 9(#9) 10(#10) 11(#11) 12(#12) 13(#13) 14(#14) 15(#15) 16(#16) 17(#17) 18(#18) 19(#19) 20(#20) 21(#21) 22(#22) 23(#23) 24(#24) 25(#25) 26(#26); X3 6(#6); X5 2(#2)

## Notes on the sheet
- tr-804-DECT_2023-07
- PCM <=> I2S#1, I2S#2
- LOAD_REG = 0
- Right
- Left
- XOR
- (near DD6) INVERTOR
- (near DD8) OR
- /RST
- (near DD8) LOAD REG = 0 только когда просадка RST_CT2 выпадает на 0 SCLK
- 3V3 - no write
  GND - write
- 0|0 = 0
- 0|1 = 1
- 1|0 = 1
- (near DD8) 0|0 = 0
- 1|1 = 1
- (near DD8) То есть, каждый второй фронт RLCK?
- GPO4
- GPO2
- GPO3
- GPO1
- 1|1 = 0
- (near DD7) INVERTOR
- (near X3) Prog.port
- PCM in
  >>
- reset CPU
- (near DD2) CPU
- SELECT UART
- I2S #2 out
  >>
- I2S #1 out
  >>
- I2S #2 in
  >>
- I2S #1 in
  >>
- PCM out
  >>
- (in symbol DA_SN74LVC(SWITCH-SOT363)) SOT363 (SC70)
- (in symbol DD_74HC4052PW) MUX/; DMUX
- (in symbol DD_AT24CXXX) SO-8
- (in symbol DD_PIC18F2XK22(QFN)) 28-QFN
- (in symbol DD_SN74AHC1G14DBVR(NOT)) SOT-23-5
- (in symbol DD_SN74AHC1G32DBVR(2OR)) SOT-23-5
- (in symbol DD_SN74AHC1G86DBVR(2XOR)) SOT-23-5
- (in symbol DD_SN74HC74D, part A) TT
- (in symbol DD_SN74HC74D, part B) TT
- (in symbol DD_SN74HC164PW) REG
- (in symbol DD_SN74HC165PW) REG

## Library data of the parts
1-3 = REPER_20-10: {Description}; SwapEquivalence: {SwapEquivalence}
C1 = 0603_MURATA_NFM18PC: {Description}; SwapEquivalence: {SwapEquivalence}
C3 = 0402_C: {Description}; SwapEquivalence: {SwapEquivalence}
C4 C5 C7 C10-C40 C56 = 0603_C: {Description}; SwapEquivalence: {SwapEquivalence}
C52 = CASEB_C+: {Description}; SwapEquivalence: {SwapEquivalence}
C53 = CASEB_C+: не закупать и не монтировать; SwapEquivalence: {SwapEquivalence}
DA1 = DECT_SC14CVMDECT: уточнить перед заказом; SwapEquivalence: {SwapEquivalence}
DA2-DA5 = DA_SN74LVC(SWITCH-SOT363): {Description}; SwapEquivalence: TS5A3159DCKR, SN74LVC1G3157DCKR(TI)
DD1 = DD_AT24CXXX: {Description}; SwapEquivalence: {SwapEquivalence}
DD2 = DD_PIC18F2XK22(QFN): {Description}; SwapEquivalence: PIC18LF26K22-I/ML
DD3 = DD_74HC4052PW: {Description}; SwapEquivalence: {SwapEquivalence}
DD4 = DD_SN74AHC1G86DBVR(2XOR): {Description}; SwapEquivalence: {SwapEquivalence}
DD5 = DD_SN74HC74D: {Description}; SwapEquivalence: {SwapEquivalence}
DD6 DD7 = DD_SN74AHC1G14DBVR(NOT): {Description}; SwapEquivalence: {SwapEquivalence}
DD8 = DD_SN74AHC1G32DBVR(2OR): {Description}; SwapEquivalence: {SwapEquivalence}
DD10-DD21 = DD_SN74HC164PW: {Description}; SwapEquivalence: {SwapEquivalence}
DD22-DD29 = DD_SN74HC165PW: {Description}; SwapEquivalence: {SwapEquivalence}
HL1 = LED_1210(LPE1-5-19): {Description}; SwapEquivalence: HSMF-C118 (Broadcom)
L1 = 0805_L: {Description}; SwapEquivalence: {SwapEquivalence}
L3 L4 = 0402_L: не закупать и не монтировать; SwapEquivalence: {SwapEquivalence}
M1 M2 = BOLT: {Description}; SwapEquivalence: {SwapEquivalence}
R7 R8 R55 R56 = 0805_R: {Description}; SwapEquivalence: {SwapEquivalence}
R9 = 0603_R: {Description}; Value: 10k 5%; SwapEquivalence: {SwapEquivalence}
R10-R21 R28-R31 R42-R49 R57 R59 R60 = 0603_R: {Description}; SwapEquivalence: {SwapEquivalence}
R24-R27 R58 = 0603_R_CAY16-J: {Description}; SwapEquivalence: {SwapEquivalence}
R50 R53 = 0603_R: не закупать и не монтировать; Value: N.M.(10k 5%); SwapEquivalence: {SwapEquivalence}
R51 R52 R54 = 0603_R: не закупать и не монтировать; SwapEquivalence: {SwapEquivalence}
SA4-SA24 = JUMPER_0603: {Description}; Value: enable; SwapEquivalence: {SwapEquivalence}
SA25 SA26 = JUMPER_0603: {Description}; Value: disable; SwapEquivalence: {SwapEquivalence}
SB1 = BUT_TC-0206: {Description}; SwapEquivalence: кнопка тактовая угловая (h=8mm)
VD1 VD2 = DIOD_SOD80C: {Description}; SwapEquivalence: {SwapEquivalence}
VT1 = VT_FDN338P: {Description}; SwapEquivalence: {SwapEquivalence}
VT2 VT3 = VT_FDV301N: {Description}; SwapEquivalence: {SwapEquivalence}
X1 = X_PBD-32: {Description}; SwapEquivalence: {SwapEquivalence}
X2 = X_PBD-26: {Description}; SwapEquivalence: {SwapEquivalence}
X3 = X_PBD2-6: {Description}; SwapEquivalence: {SwapEquivalence}
X4 = X_SMA_HYR-1142: закупить но не монтировать; SwapEquivalence: {SwapEquivalence}
X5 = X_IDC-6: {Description}; SwapEquivalence: {SwapEquivalence}
X6 X7 = X_PLS-5: {Description}; SwapEquivalence: {SwapEquivalence}
X8 = X_IDC-14: {Description}; SwapEquivalence: {SwapEquivalence}